# Altium schematic sheet 01 Revision History and Contents.SchDoc: ECE453TutorialBoard
size B; DrawnBy: JMP; Engineer: JMP; ProjectName: ECE453TutorialBoard
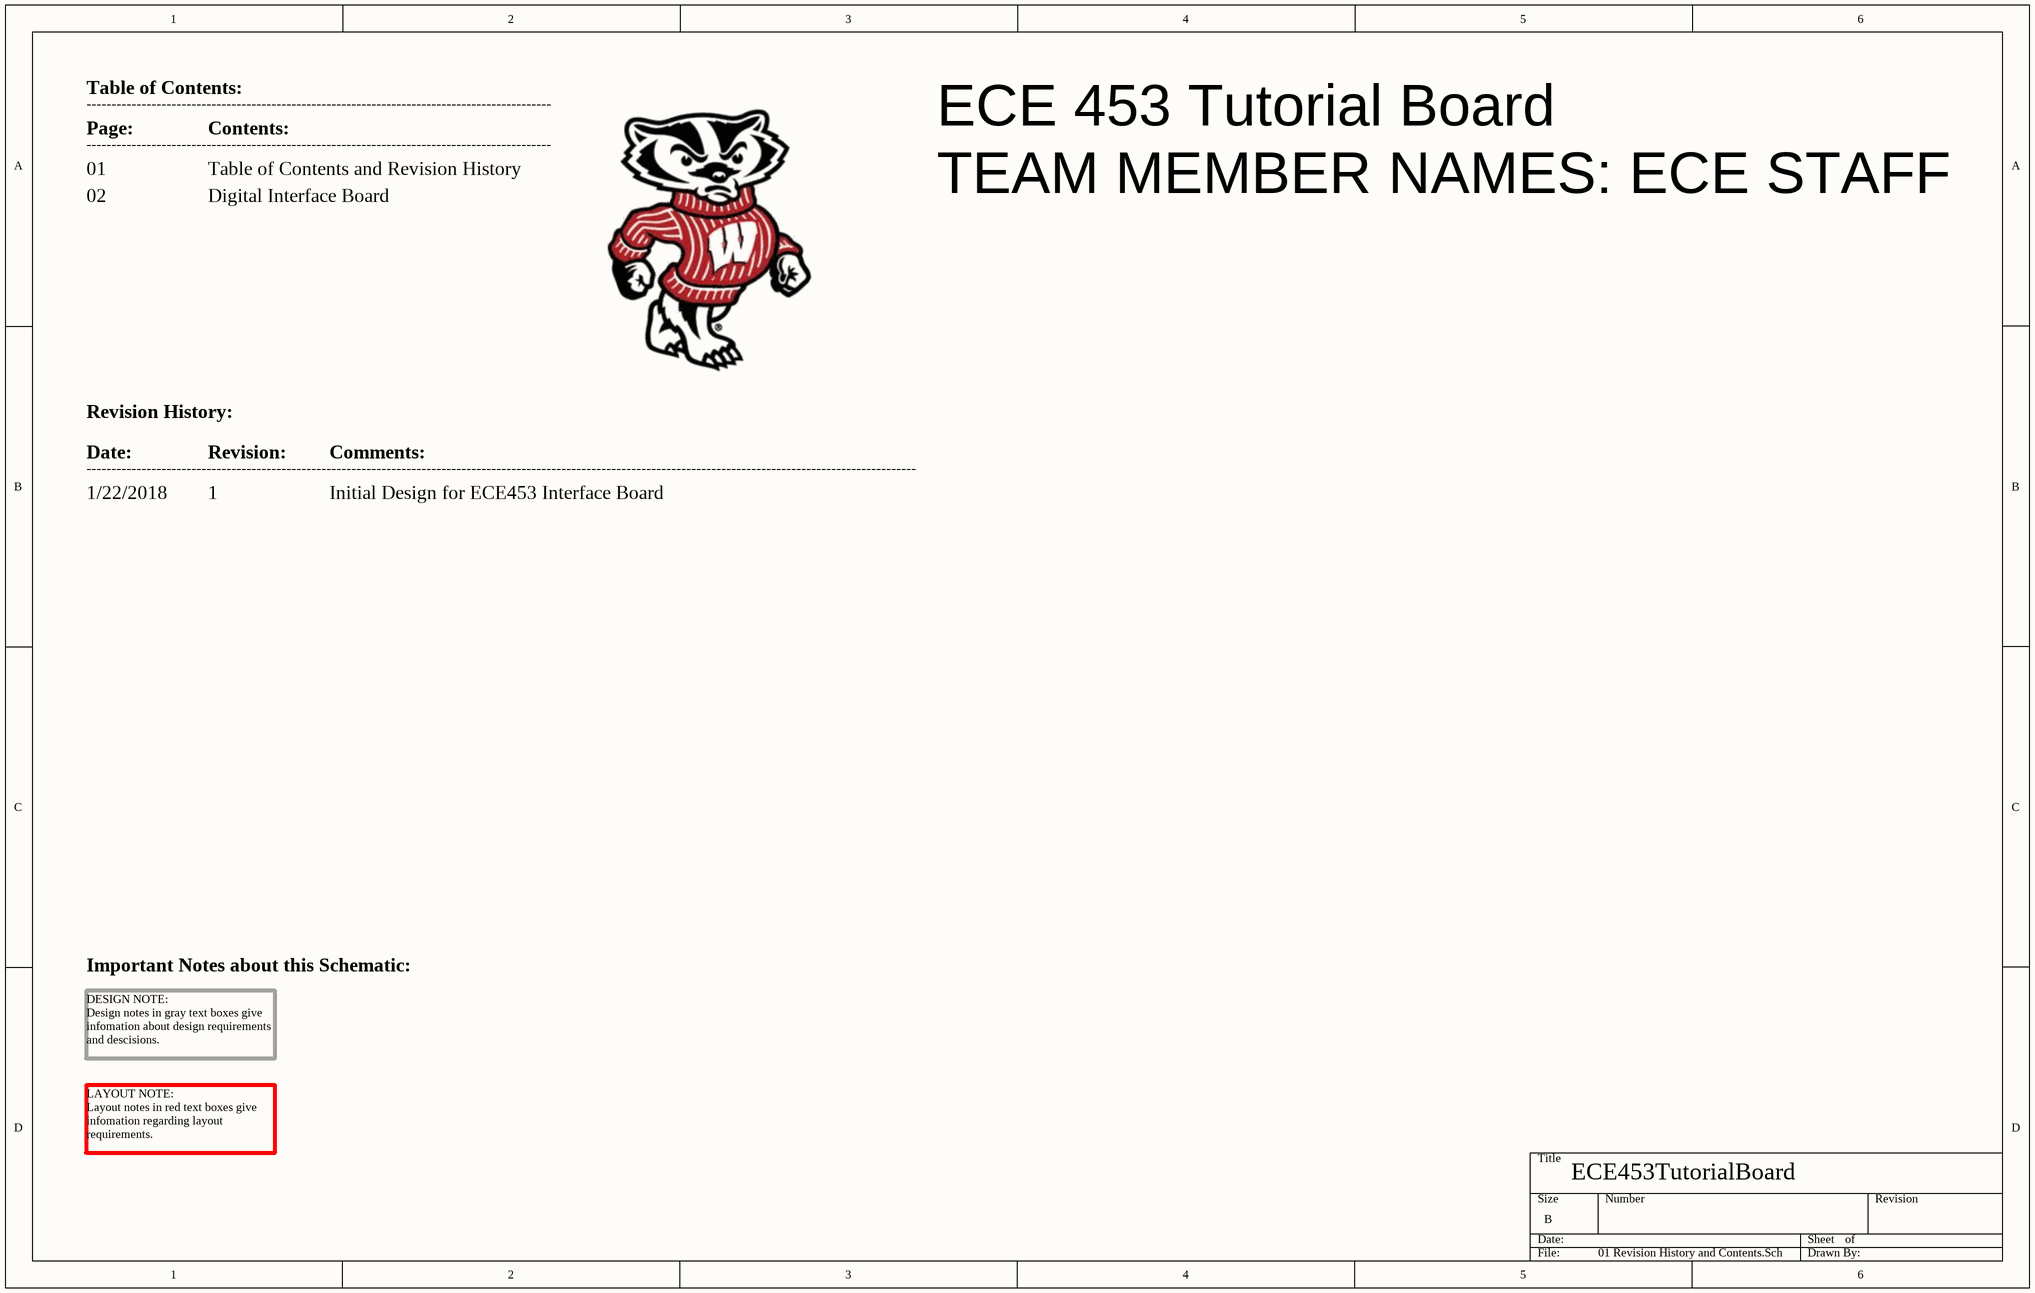
[diagram p0: 01 Revision History and Contents.SchDoc]

## Notes on the sheet
- Table of Contents:
- Page:
- ---------------------------------------------------------------------------------------------
- Contents:
- ECE 453 Tutorial Board
- 01
- 02
- Table of Contents and Revision History
- Digital Interface Board
- TEAM MEMBER NAMES: ECE STAFF
- Revision History:
- Date:
- 1/22/2018
- ----------------------------------------------------------------------------------------------------------------------------------------------------------------------
- Revision:
- 1
- Comments:
- Initial Design for ECE453 Interface Board
- Important Notes about this Schematic:
- DESIGN NOTE:
  Design notes in gray text boxes give infomation about design requirements and descisions.
- LAYOUT NOTE:
  Layout notes in red text boxes give infomation regarding layout requirements.